# EasyEDA schematic 6502v2 lcd connector.json
TITLE: Sheet_1; REV: 1.0; Date: 2023-08-14; Sheet: 1/1; Drawn By: breckcmassey; Company: Your Company
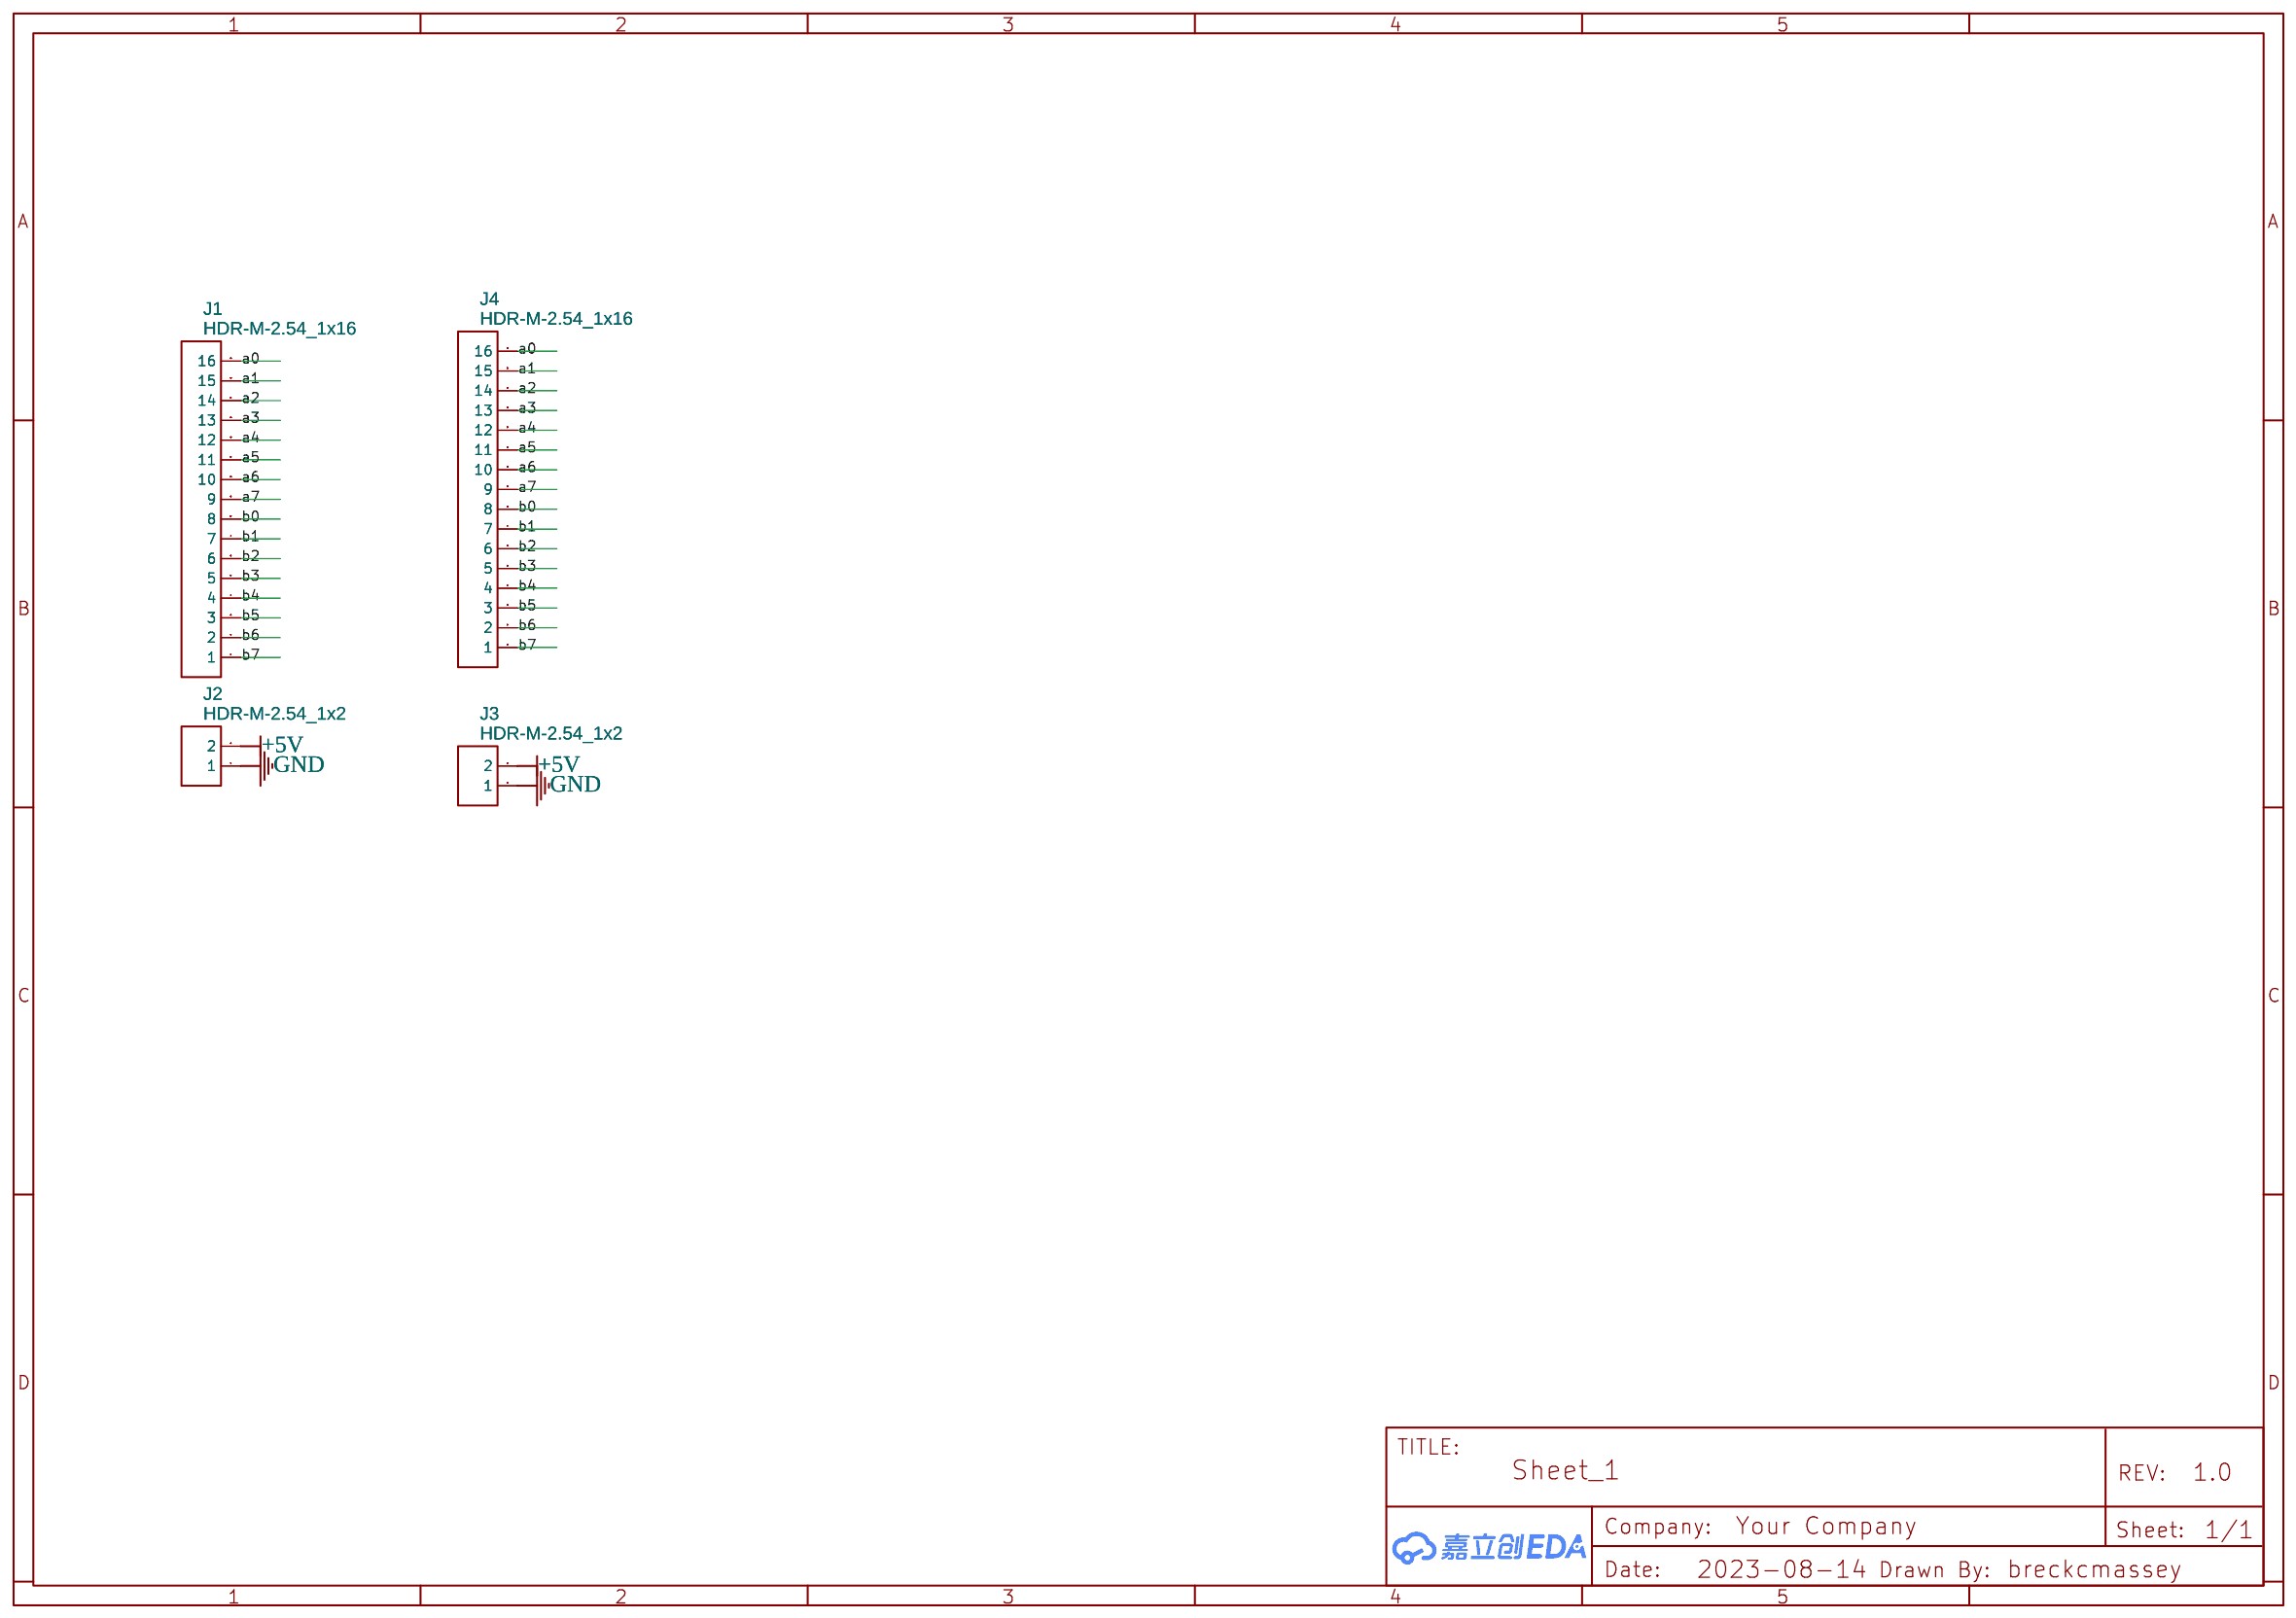
[diagram p0: schematic sheet]

## Parts
J1  HDR-M-2.54_1x16  [HDR-M-2.54_1X16]
J2  HDR-M-2.54_1x2  [HDR-M-2.54_1X2]
J3  HDR-M-2.54_1x2  [HDR-M-2.54_1X2]
J4  HDR-M-2.54_1x16  [HDR-M-2.54_1X16]

## Library data of the parts
J1 J4 = HDR-M-2.54_1x16: Supplier: LCSC; Contributor: LCEDA_Lib
J2 J3 = HDR-M-2.54_1x2: Supplier Part: C124375; Supplier: LCSC; Contributor: LCEDA_Lib

## Nets
+5V: J2.2 J3.2
GND: J2.1 J3.1
a0: J1.16 J4.16
a1: J1.15 J4.15
a2: J1.14 J4.14
a3: J1.13 J4.13
a4: J1.12 J4.12
a5: J1.11 J4.11
a6: J1.10 J4.10
a7: J1.9 J4.9
b0: J1.8 J4.8
b1: J1.7 J4.7
b2: J1.6 J4.6
b3: J1.5 J4.5
b4: J1.4 J4.4
b5: J1.3 J4.3
b6: J1.2 J4.2
b7: J1.1 J4.1
